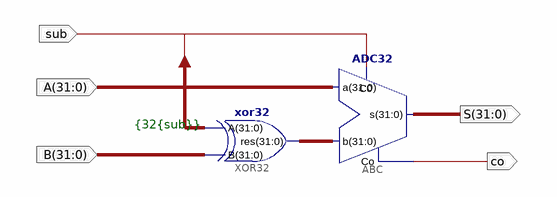
[diagram p0: schematic sheet 1]
// Xilinx ISE schematic ABC32.sch (kintex7) as structural Verilog: 2 symbols, 5 ports
module ABC32 (
  input  [31:0] A,
  input  [31:0] B,
  input  sub,
  output [31:0] S,
  output co
);

  wire [31:0] XLXN_1;

  xor32 XOR32 (.A({32{sub}}), .B(B), .res(XLXN_1));
  ADC32 ABC (.b(XLXN_1), .a(A), .C0(sub), .s(S), .Co(co));

  // Notes on the sheet:
  //   {32{sub}}
endmodule
